# Altium project Soil Sensor Data Logger.PrjPcb
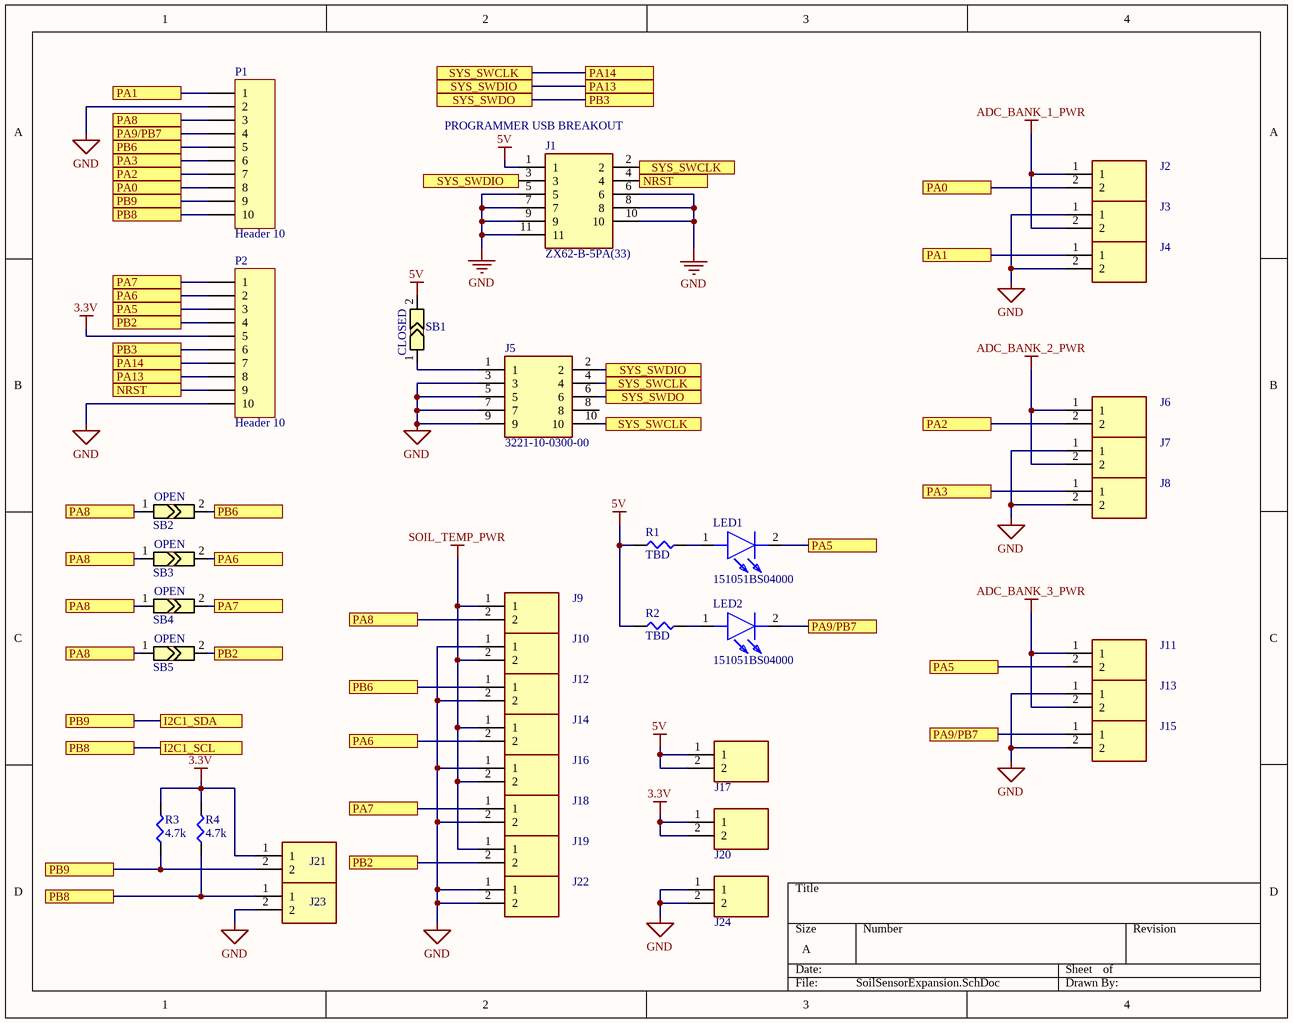
[diagram p0: SoilSensorExpansion.SchDoc]
3 sheets, 58 parts. Net scope: flat (ports and power ports of the same name join across sheets).
Board file: layout.PcbDoc
Sheets:
  SoilSensorExpansion.SchDoc
  sch_pwr.SchDoc
  sch_expansion.SchDoc

## Sheet SoilSensorExpansion.SchDoc
size A; SheetNumber: 1; SheetTotal: 3

### Parts
J1  ZX62-B-5PA(33)  [ZX62B5PA33]
J2  691214110002S  [691214110002S]  (value not drawn)
J3  691214110002S  [691214110002S]  (value not drawn)
J4  691214110002S  [691214110002S]  (value not drawn)
J5  3221-10-0300-00  [322110030000]
J6  691214110002S  [691214110002S]  (value not drawn)
J7  691214110002S  [691214110002S]  (value not drawn)
J8  691214110002S  [691214110002S]  (value not drawn)
J9  691214110002S  [691214110002S]  (value not drawn)
J10  691214110002S  [691214110002S]  (value not drawn)
J11  691214110002S  [691214110002S]  (value not drawn)
J12  691214110002S  [691214110002S]  (value not drawn)
J13  691214110002S  [691214110002S]  (value not drawn)
J14  691214110002S  [691214110002S]  (value not drawn)
J15  691214110002S  [691214110002S]  (value not drawn)
J16  691214110002S  [691214110002S]  (value not drawn)
J17  691214110002S  [691214110002S]  (value not drawn)
J18  691214110002S  [691214110002S]  (value not drawn)
J19  691214110002S  [691214110002S]  (value not drawn)
J20  691214110002S  [691214110002S]  (value not drawn)
J21  691214110002S  [691214110002S]  (value not drawn)
J22  691214110002S  [691214110002S]  (value not drawn)
J23  691214110002S  [691214110002S]  (value not drawn)
J24  691214110002S  [691214110002S]  (value not drawn)
LED1  151051BS04000  [151051BS04000]
LED2  151051BS04000  [151051BS04000]
P1  Header 10  [HDR1X10]
P2  Header 10  [HDR1X10]
R1  TBD  [SMD-0805-RES]
R2  TBD  [SMD-0805-RES]
R3  4.7k  [SMD-0402-RES]
R4  4.7k  [SMD-0402-RES]
SB1  SOLDER_JUMPER  [JUMPER_SMD]  (value not drawn)
SB2  SOLDER_JUMPER  [JUMPER_SMD]  (value not drawn)
SB3  SOLDER_JUMPER  [JUMPER_SMD]  (value not drawn)
SB4  SOLDER_JUMPER  [JUMPER_SMD]  (value not drawn)
SB5  SOLDER_JUMPER  [JUMPER_SMD]  (value not drawn)

### Ports
I2C1_SCL, I2C1_SDA, NRST, PA0, PA1, PA2, PA3, PA5, PA6, PA7, PA8, PA9/PB7, PA13, PA14, PB2, PB3, PB6, PB8, PB9, SYS_SWCLK, SYS_SWDIO, SYS_SWDO

### Nets
3.3V: J20.1 J20.2 J21.1 P2.5 R3.2 R4.2
5V: J1.1 J17.1 J17.2 R1.1 R2.1 SB1.2
ADC_BANK_1_PWR: J2.1 J3.2
ADC_BANK_2_PWR: J6.1 J7.2
ADC_BANK_3_PWR: J11.1 J13.2
GND: J1.5 J1.6 J1.7 J1.8 J1.9 J1.10 J1.11 J3.1 J4.2 J5.3 J5.5 J5.7 J5.9 J7.1 J8.2 J10.1 J12.2 J13.1 J15.2 J16.1 J18.2 J22.1 J22.2 J23.2 J24.1 J24.2 P1.2 P2.10
SOIL_TEMP_PWR: J9.1 J10.2 J14.1 J16.2 J19.1
NetJ1_2: J1.2 J5.4 J5.10 P2.7 ; port PA14, port SYS_SWCLK
NetJ1_3: J1.3 J5.2 P2.8 ; port PA13, port SYS_SWDIO
NetJ1_4: J1.4 P2.9 ; port NRST
NetJ2_2: J2.2 P1.8 ; port PA0
NetJ4_1: J4.1 P1.1 ; port PA1
NetJ5_1: J5.1 SB1.1
NetJ5_6: J5.6 P2.6 ; port PB3, port SYS_SWDO
NetJ6_2: J6.2 P1.7 ; port PA2
NetJ8_1: J8.1 P1.6 ; port PA3
NetJ9_2: J9.2 P1.3 SB2.1 SB3.1 SB4.1 SB5.1 ; port PA8
NetJ11_2: J11.2 LED1.2(K) P2.3 ; port PA5
NetJ12_1: J12.1 P1.5 SB2.2 ; port PB6
NetJ14_2: J14.2 P2.2 SB3.2 ; port PA6
NetJ15_1: J15.1 LED2.2(K) P1.4 ; port PA9/PB7
NetJ18_1: J18.1 P2.1 SB4.2 ; port PA7
NetJ19_2: J19.2 P2.4 SB5.2 ; port PB2
NetJ21_2: J21.2 P1.9 R3.1 ; port PB9, port I2C1_SDA
NetJ23_1: J23.1 P1.10 R4.1 ; port PB8, port I2C1_SCL
NetLED1_1: LED1.1(A) R1.2
NetLED2_1: LED2.1(A) R2.2

Not connected (* = marked no-connect by the designer): J5 8

### Notes on the sheet
- (near J1) PROGRAMMER USB BREAKOUT
- (near SB1) CLOSED
- (near SB2) OPEN
- (near SB3) OPEN
- (near SB4) OPEN
- (near SB5) OPEN

### Library data of the parts
J1 = ZX62-B-5PA(33): Connector; Manufacturer_Name: Hirose; Datasheet Link: http://www.mouser.com/ds/2/185/ZX_catalog-939768.pdf; Height: 2.8mm; Manufacturer_Part_Number: ZX62-B-5PA(33); Mouser Part Number: 798-ZX62-B-5PA33; Mouser Price/Stock: https://www.mouser.com/Search/Refine.aspx?Keyword=798-ZX62-B-5PA33; RS Part Number: 1362267; RS Price/Stock: http://uk.rs-online.com/web/p/products/1362267
J2-J4 J6-J24 = 691214110002S: Connector; Manufacturer_Name: Wurth Elektronik; Datasheet Link: https://katalog.we-online.de/em/datasheet/6912141100xx.pdf; Height: 8.7mm; Manufacturer_Part_Number: 691214110002S; Mouser Part Number: 710-691214110002S; Mouser Price/Stock: https://www.mouser.co.uk/ProductDetail/Wurth-Elektronik/691214110002S?qs=w%2Fv1CP2dgqrp3US926hqig%3D%3D
J5 = 3221-10-0300-00: Connector; Manufacturer_Name: CNC Tech; Datasheet Link: http://cnctech.us/pdfs/3221-XX-0300-00.pdf; Height: 5.8mm; Manufacturer_Part_Number: 3221-10-0300-00; Arrow Part Number: 3221-10-0300-00; Arrow Price/Stock: https://www.arrow.com/en/products/3221-10-0300-00/cnc-tech-llc
LED1 LED2 = 151051BS04000: LED; Manufacturer_Name: Wurth Elektronik; Datasheet Link: https://katalog.we-online.de/led/datasheet/151051BS04000.pdf; Height: 8.95mm; Manufacturer_Part_Number: 151051BS04000; Mouser Part Number: 710-151051BS04000; Mouser Price/Stock: https://www.mouser.co.uk/ProductDetail/Wurth-Elektronik/151051BS04000?qs=LlUlMxKIyB3OjuZOlqaOjg%3D%3D
P1 P2 = Header 10: Header, 10-Pin; LatestRevisionDate: 17-Jul-2002; LatestRevisionNote: Re-released for DXP Platform.; Publisher: Altium Limited
R1 R2 = ERJ-6ENF5492V: RES SMD 54.9K OHM 1% 1/8W 0805; Manufacturer: Panasonic Electronic Components; Factory Stock: 0; Unit Price (USD): 0.00729; @ qty: 1500; Minimum Quantity: 1; Power (Watts): 0.125W, 1/8W; Temperature Coefficient: ±100ppm/°C; Part Number: ERJ-6ENF5492V; Datasheets: http://industrial.panasonic.com/www-cgi/jvcr13pz.cgi?E+PZ+3+AOA0002+ERJ6ENF5492V+7+WW; Image: //media.digikey.com/Renders/Panasonic%20Renders/ERJ-0805%20Pkg.jpg; Digi-Key Part Number: P54.9KCCT-ND; Quantity Available: 38560; Packaging: Cut Tape (CT); Series: ERJ; Part Status: Active; Value: 54.9k; Tolerance: ±1%; Composition: Thick Film; Features: Automotive AEC-Q200; Operating Temperature: -55°C ~ 155°C; Package / Case: 0805 (2012 Metric); Supplier Device Package: 0805; Size / Dimension: 0.079" L x 0.049" W (2.00mm x 1.25mm); Height - Seated (Max): 0.028" (0.70mm); Number of Terminations: 2; Failure Rate: -
R3 R4 = ERJ-2GEJ103X: RES SMD 4.7K OHM 5% 1/10W 0402; Manufacturer: Panasonic Electronic Components; Factory Stock: 0; Unit Price (USD): 0.00350; @ qty: 1500; Minimum Quantity: 1; Power (Watts): 0.1W, 1/10W; Temperature Coefficient: ±200ppm/°C; Part Number: ERJ-2GEJ103X; Datasheets: http://industrial.panasonic.com/www-cgi/jvcr13pz.cgi?E+PZ+3+AOA0001+ERJ2GEJ103X+7+WW; Image: //media.digikey.com/Photos/Panasonic%20Photos/ERJ-PA2-Series.jpg; Digi-Key Part Number: P10KJCT-ND; Quantity Available: 2560215; Packaging: Cut Tape (CT); Series: ERJ; Part Status: Active; Value: 4.7k; Tolerance: ±5%; Composition: Thick Film; Features: Automotive AEC-Q200; Operating Temperature: -55°C ~ 155°C; Package / Case: 0402 (1005 Metric); Supplier Device Package: 0402; Size / Dimension: 0.039" L x 0.020" W (1.00mm x 0.50mm); Height - Seated (Max): 0.016" (0.40mm); Number of Terminations: 2; Failure Rate: -

## Sheet sch_pwr.SchDoc
size A; SheetNumber: 2; SheetTotal: 3
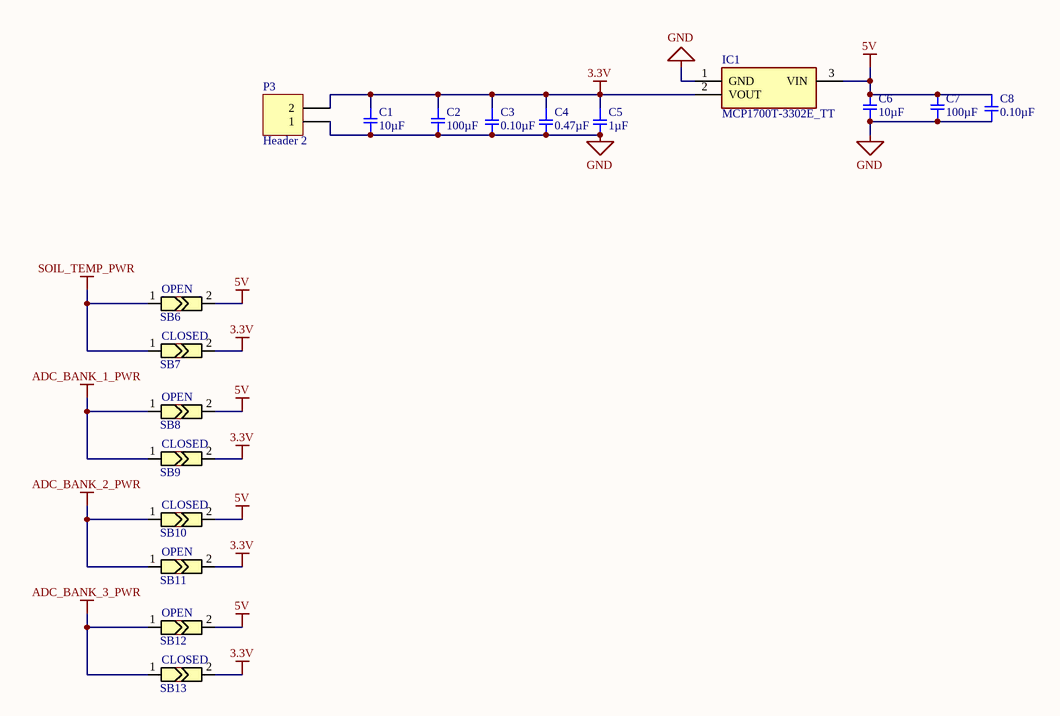
[diagram p1: sch_pwr.SchDoc]

### Parts
C1  10µF  [SMD-0805C]
C2  100µF  [SMD-0805C]
C3  0.10µF  [SMD-0402C]
C4  0.47µF  [SMD-0402C]
C5  1µF  [SMD-0402C]
C6  10µF  [SMD-0805C]
C7  100µF  [SMD-0805C]
C8  0.10µF  [SMD-0402C]
IC1  MCP1700T-3302E_TT  [SOT95P237X112-3N]
P3  Header 2  [HDR1X2]
SB6  SOLDER_JUMPER  [JUMPER_SMD]  (value not drawn)
SB7  SOLDER_JUMPER  [JUMPER_SMD]  (value not drawn)
SB8  SOLDER_JUMPER  [JUMPER_SMD]  (value not drawn)
SB9  SOLDER_JUMPER  [JUMPER_SMD]  (value not drawn)
SB10  SOLDER_JUMPER  [JUMPER_SMD]  (value not drawn)
SB11  SOLDER_JUMPER  [JUMPER_SMD]  (value not drawn)
SB12  SOLDER_JUMPER  [JUMPER_SMD]  (value not drawn)
SB13  SOLDER_JUMPER  [JUMPER_SMD]  (value not drawn)

### Nets
3.3V: C1.2 C2.2 C3.1 C4.1 C5.1 IC1.2(VOUT) P3.2 SB7.2 SB9.2 SB11.2 SB13.2
5V: C6.2 C7.2 C8.1 IC1.3(VIN) SB6.2 SB8.2 SB10.2 SB12.2
ADC_BANK_1_PWR: SB8.1 SB9.1
ADC_BANK_2_PWR: SB10.1 SB11.1
ADC_BANK_3_PWR: SB12.1 SB13.1
GND: C1.1 C2.1 C3.2 C4.2 C5.2 C6.1 C7.1 C8.2 IC1.1(GND) P3.1
SOIL_TEMP_PWR: SB6.1 SB7.1

### Notes on the sheet
- (near SB7) CLOSED
- (near SB6) OPEN
- (near SB8) OPEN
- (near SB9) CLOSED
- (near SB10) CLOSED
- (near SB11) OPEN
- (near SB12) OPEN
- (near SB13) CLOSED

### Library data of the parts
C1 C6 = GCJ21BR71H683KA01L: CAP CER 10UF 50V X7R 0805; Manufacturer: Murata Electronics North America; Factory Stock: 0; Unit Price (USD): 0.24; Minimum Quantity: 1; Tolerance: ±10%; Datasheets: http://www.murata.com/~/media/webrenewal/support/library/catalog/products/capacitor/mlcc/c03e.ashx; Image: //media.digikey.com/Renders/Murata%20Renders/0805%20(2012%20Metric)%20.85mm.jpg; Digi-Key Part Number: 490-5807-1-ND; Part Number: GCJ21BR71H683KA01L; Quantity Available: 4490; @ qty: 0; Packaging: Cut Tape (CT); Series: GCJ; Part Status: Active; Value: 10µF; Voltage: 50V; Temperature Coefficient: X7R; Operating Temperature: -55°C ~ 125°C; Features: Soft Termination; Ratings: AEC-Q200; Applications: Automotive, Boardflex Sensitive; Mounting Type: Surface Mount, MLCC; Package / Case: 0805 (2012 Metric); Size / Dimension: 0.079" L x 0.049" W (2.00mm x 1.25mm); Height - Seated (Max): -; Thickness (Max): 0.057" (1.45mm); Lead Spacing: -; Lead Style: -
C2 C7 = GCJ21BR71H683KA01L: CAP CER 100UF 50V X7R 0805; Manufacturer: Murata Electronics North America; Factory Stock: 0; Unit Price (USD): 0.24; Minimum Quantity: 1; Tolerance: ±10%; Datasheets: http://www.murata.com/~/media/webrenewal/support/library/catalog/products/capacitor/mlcc/c03e.ashx; Image: //media.digikey.com/Renders/Murata%20Renders/0805%20(2012%20Metric)%20.85mm.jpg; Digi-Key Part Number: 490-5807-1-ND; Part Number: GCJ21BR71H683KA01L; Quantity Available: 4490; @ qty: 0; Packaging: Cut Tape (CT); Series: GCJ; Part Status: Active; Value: 100µF; Voltage: 50V; Temperature Coefficient: X7R; Operating Temperature: -55°C ~ 125°C; Features: Soft Termination; Ratings: AEC-Q200; Applications: Automotive, Boardflex Sensitive; Mounting Type: Surface Mount, MLCC; Package / Case: 0805 (2012 Metric); Size / Dimension: 0.079" L x 0.049" W (2.00mm x 1.25mm); Height - Seated (Max): -; Thickness (Max): 0.057" (1.45mm); Lead Spacing: -; Lead Style: -
C3 C8 = GCM155R71C104KA55D: CAP CER 0.1UF 16V X7R 0402; Manufacturer: Murata Electronics North America; Factory Stock: 0; Unit Price (USD): 0.1; Minimum Quantity: 1; Tolerance: ±10%; Datasheets: http://www.murata.com/~/media/webrenewal/support/library/catalog/products/capacitor/mlcc/c03e.ashx; Image: //media.digikey.com/Renders/Murata%20Renders/ZRB-SERIES-0402.jpg; Digi-Key Part Number: 490-4759-1-ND; Part Number: GCM155R71C104KA55D; Quantity Available: 734194; @ qty: 0; Packaging: Cut Tape (CT); Series: GCM; Part Status: Active; Value: 0.10µF; Voltage: 16V; Temperature Coefficient: X7R; Operating Temperature: -55°C ~ 125°C; Features: -; Ratings: AEC-Q200; Applications: Automotive; Mounting Type: Surface Mount, MLCC; Package / Case: 0402 (1005 Metric); Size / Dimension: 0.039" L x 0.020" W (1.00mm x 0.50mm); Height - Seated (Max): -; Thickness (Max): 0.022" (0.55mm); Lead Spacing: -; Lead Style: -
C4 = GCM155R71C104KA55D: CAP CER 0.47UF 16V X7R 0402; Manufacturer: Murata Electronics North America; Factory Stock: 0; Unit Price (USD): 0.1; Minimum Quantity: 1; Tolerance: ±10%; Datasheets: http://www.murata.com/~/media/webrenewal/support/library/catalog/products/capacitor/mlcc/c03e.ashx; Image: //media.digikey.com/Renders/Murata%20Renders/ZRB-SERIES-0402.jpg; Digi-Key Part Number: 490-4759-1-ND; Part Number: GCM155R71C104KA55D; Quantity Available: 734194; @ qty: 0; Packaging: Cut Tape (CT); Series: GCM; Part Status: Active; Value: 0.47µF; Voltage: 16V; Temperature Coefficient: X7R; Operating Temperature: -55°C ~ 125°C; Features: -; Ratings: AEC-Q200; Applications: Automotive; Mounting Type: Surface Mount, MLCC; Package / Case: 0402 (1005 Metric); Size / Dimension: 0.039" L x 0.020" W (1.00mm x 0.50mm); Height - Seated (Max): -; Thickness (Max): 0.022" (0.55mm); Lead Spacing: -; Lead Style: -
C5 = GCM155R71C104KA55D: CAP CER 1UF 16V X7R 0402; Manufacturer: Murata Electronics North America; Factory Stock: 0; Unit Price (USD): 0.1; Minimum Quantity: 1; Tolerance: ±10%; Datasheets: http://www.murata.com/~/media/webrenewal/support/library/catalog/products/capacitor/mlcc/c03e.ashx; Image: //media.digikey.com/Renders/Murata%20Renders/ZRB-SERIES-0402.jpg; Digi-Key Part Number: 490-4759-1-ND; Part Number: GCM155R71C104KA55D; Quantity Available: 734194; @ qty: 0; Packaging: Cut Tape (CT); Series: GCM; Part Status: Active; Value: 1µF; Voltage: 16V; Temperature Coefficient: X7R; Operating Temperature: -55°C ~ 125°C; Features: -; Ratings: AEC-Q200; Applications: Automotive; Mounting Type: Surface Mount, MLCC; Package / Case: 0402 (1005 Metric); Size / Dimension: 0.039" L x 0.020" W (1.00mm x 0.50mm); Height - Seated (Max): -; Thickness (Max): 0.022" (0.55mm); Lead Spacing: -; Lead Style: -
IC1 = MCP1700T-3302E_TT: Integrated Circuit; Manufacturer_Name: Microchip; Manufacturer_Part_Number: MCP1700T-3302E/TT; Datasheet Link: http://docs-emea.rs-online.com/webdocs/0dd1/0900766b80dd189b.pdf; Height: 1.12mm; Arrow Part Number: MCP1700T-3302E/TT; Arrow Price/Stock: https://www.arrow.com/en/products/mcp1700t-3302ett/microchip-technology; Mouser Part Number: 579-MCP1700T3302E/TT; Mouser Price/Stock: https://www.mouser.co.uk/ProductDetail/Microchip-Technology/MCP1700T-3302E-TT?qs=fM4xO01eazPmCNDrdHEdaw%3D%3D
P3 = Header 2: Header, 2-Pin; LatestRevisionDate: 17-Jul-2002; LatestRevisionNote: Re-released for DXP Platform.; Publisher: Altium Limited

## Sheet sch_expansion.SchDoc
size A; SheetNumber: 3; SheetTotal: 3
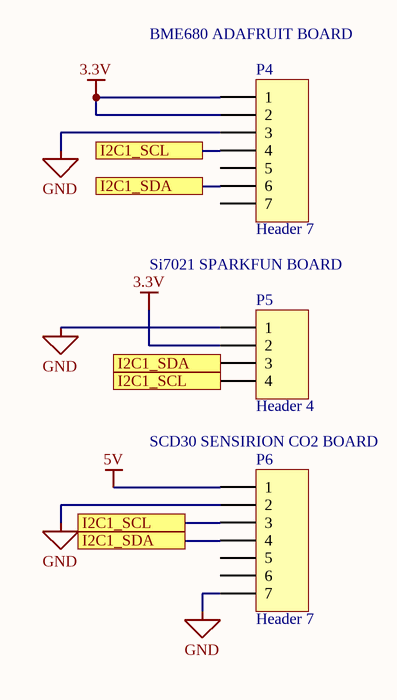
[diagram p2: sch_expansion.SchDoc]

### Parts
P4  Header 7  [HDR1X7]
P5  Header 4  [HDR1X4]
P6  Header 7  [HDR1X7]

### Ports
I2C1_SCL, I2C1_SDA

### Nets
3.3V: P4.1 P4.2 P5.2
5V: P6.1
GND: P4.3 P5.1 P6.2 P6.7
NetJ21_2: P4.6 P5.3 P6.4 ; port I2C1_SDA
NetJ23_1: P4.4 P5.4 P6.3 ; port I2C1_SCL

Not connected (* = marked no-connect by the designer): P4 5 7; P6 5 6

### Notes on the sheet
- (near P4) BME680 ADAFRUIT BOARD
- Si7021 SPARKFUN BOARD
- SCD30 SENSIRION CO2 BOARD

### Library data of the parts
P4 P6 = Header 7: Header, 7-Pin; LatestRevisionDate: 17-Jul-2002; LatestRevisionNote: Re-released for DXP Platform.; Publisher: Altium Limited
P5 = Header 4: Header, 4-Pin; LatestRevisionDate: 17-Jul-2002; LatestRevisionNote: Re-released for DXP Platform.; Publisher: Altium Limited

## Nets that join several sheets
3.3V: SoilSensorExpansion (6 pins), sch_pwr (11 pins), sch_expansion (P4.1 P4.2 P5.2)
5V: SoilSensorExpansion (6 pins), sch_pwr (8 pins), sch_expansion (P6.1)
ADC_BANK_1_PWR: SoilSensorExpansion (J2.1 J3.2), sch_pwr (SB8.1 SB9.1)
ADC_BANK_2_PWR: SoilSensorExpansion (J6.1 J7.2), sch_pwr (SB10.1 SB11.1)
ADC_BANK_3_PWR: SoilSensorExpansion (J11.1 J13.2), sch_pwr (SB12.1 SB13.1)
GND: SoilSensorExpansion (28 pins), sch_pwr (10 pins), sch_expansion (P4.3 P5.1 P6.2 P6.7)
SOIL_TEMP_PWR: SoilSensorExpansion (5 pins), sch_pwr (SB6.1 SB7.1)
NetJ21_2: SoilSensorExpansion (J21.2 P1.9 R3.1), sch_expansion (P4.6 P5.3 P6.4)
NetJ23_1: SoilSensorExpansion (J23.1 P1.10 R4.1), sch_expansion (P4.4 P5.4 P6.3)